# EasyEDA Pro project ProPrj_主车电路板.epro, schematic 主控板
Board Name: 主控板; Create Date: 2025-03-30; Page Name: P1; Project Name: 主车电路板; Schematic Name: 主控板; Update Date: 2025-04-03; Company: 嘉立创EDA; Drawed: 李子晞; Page Size: A4; Version: V1.0
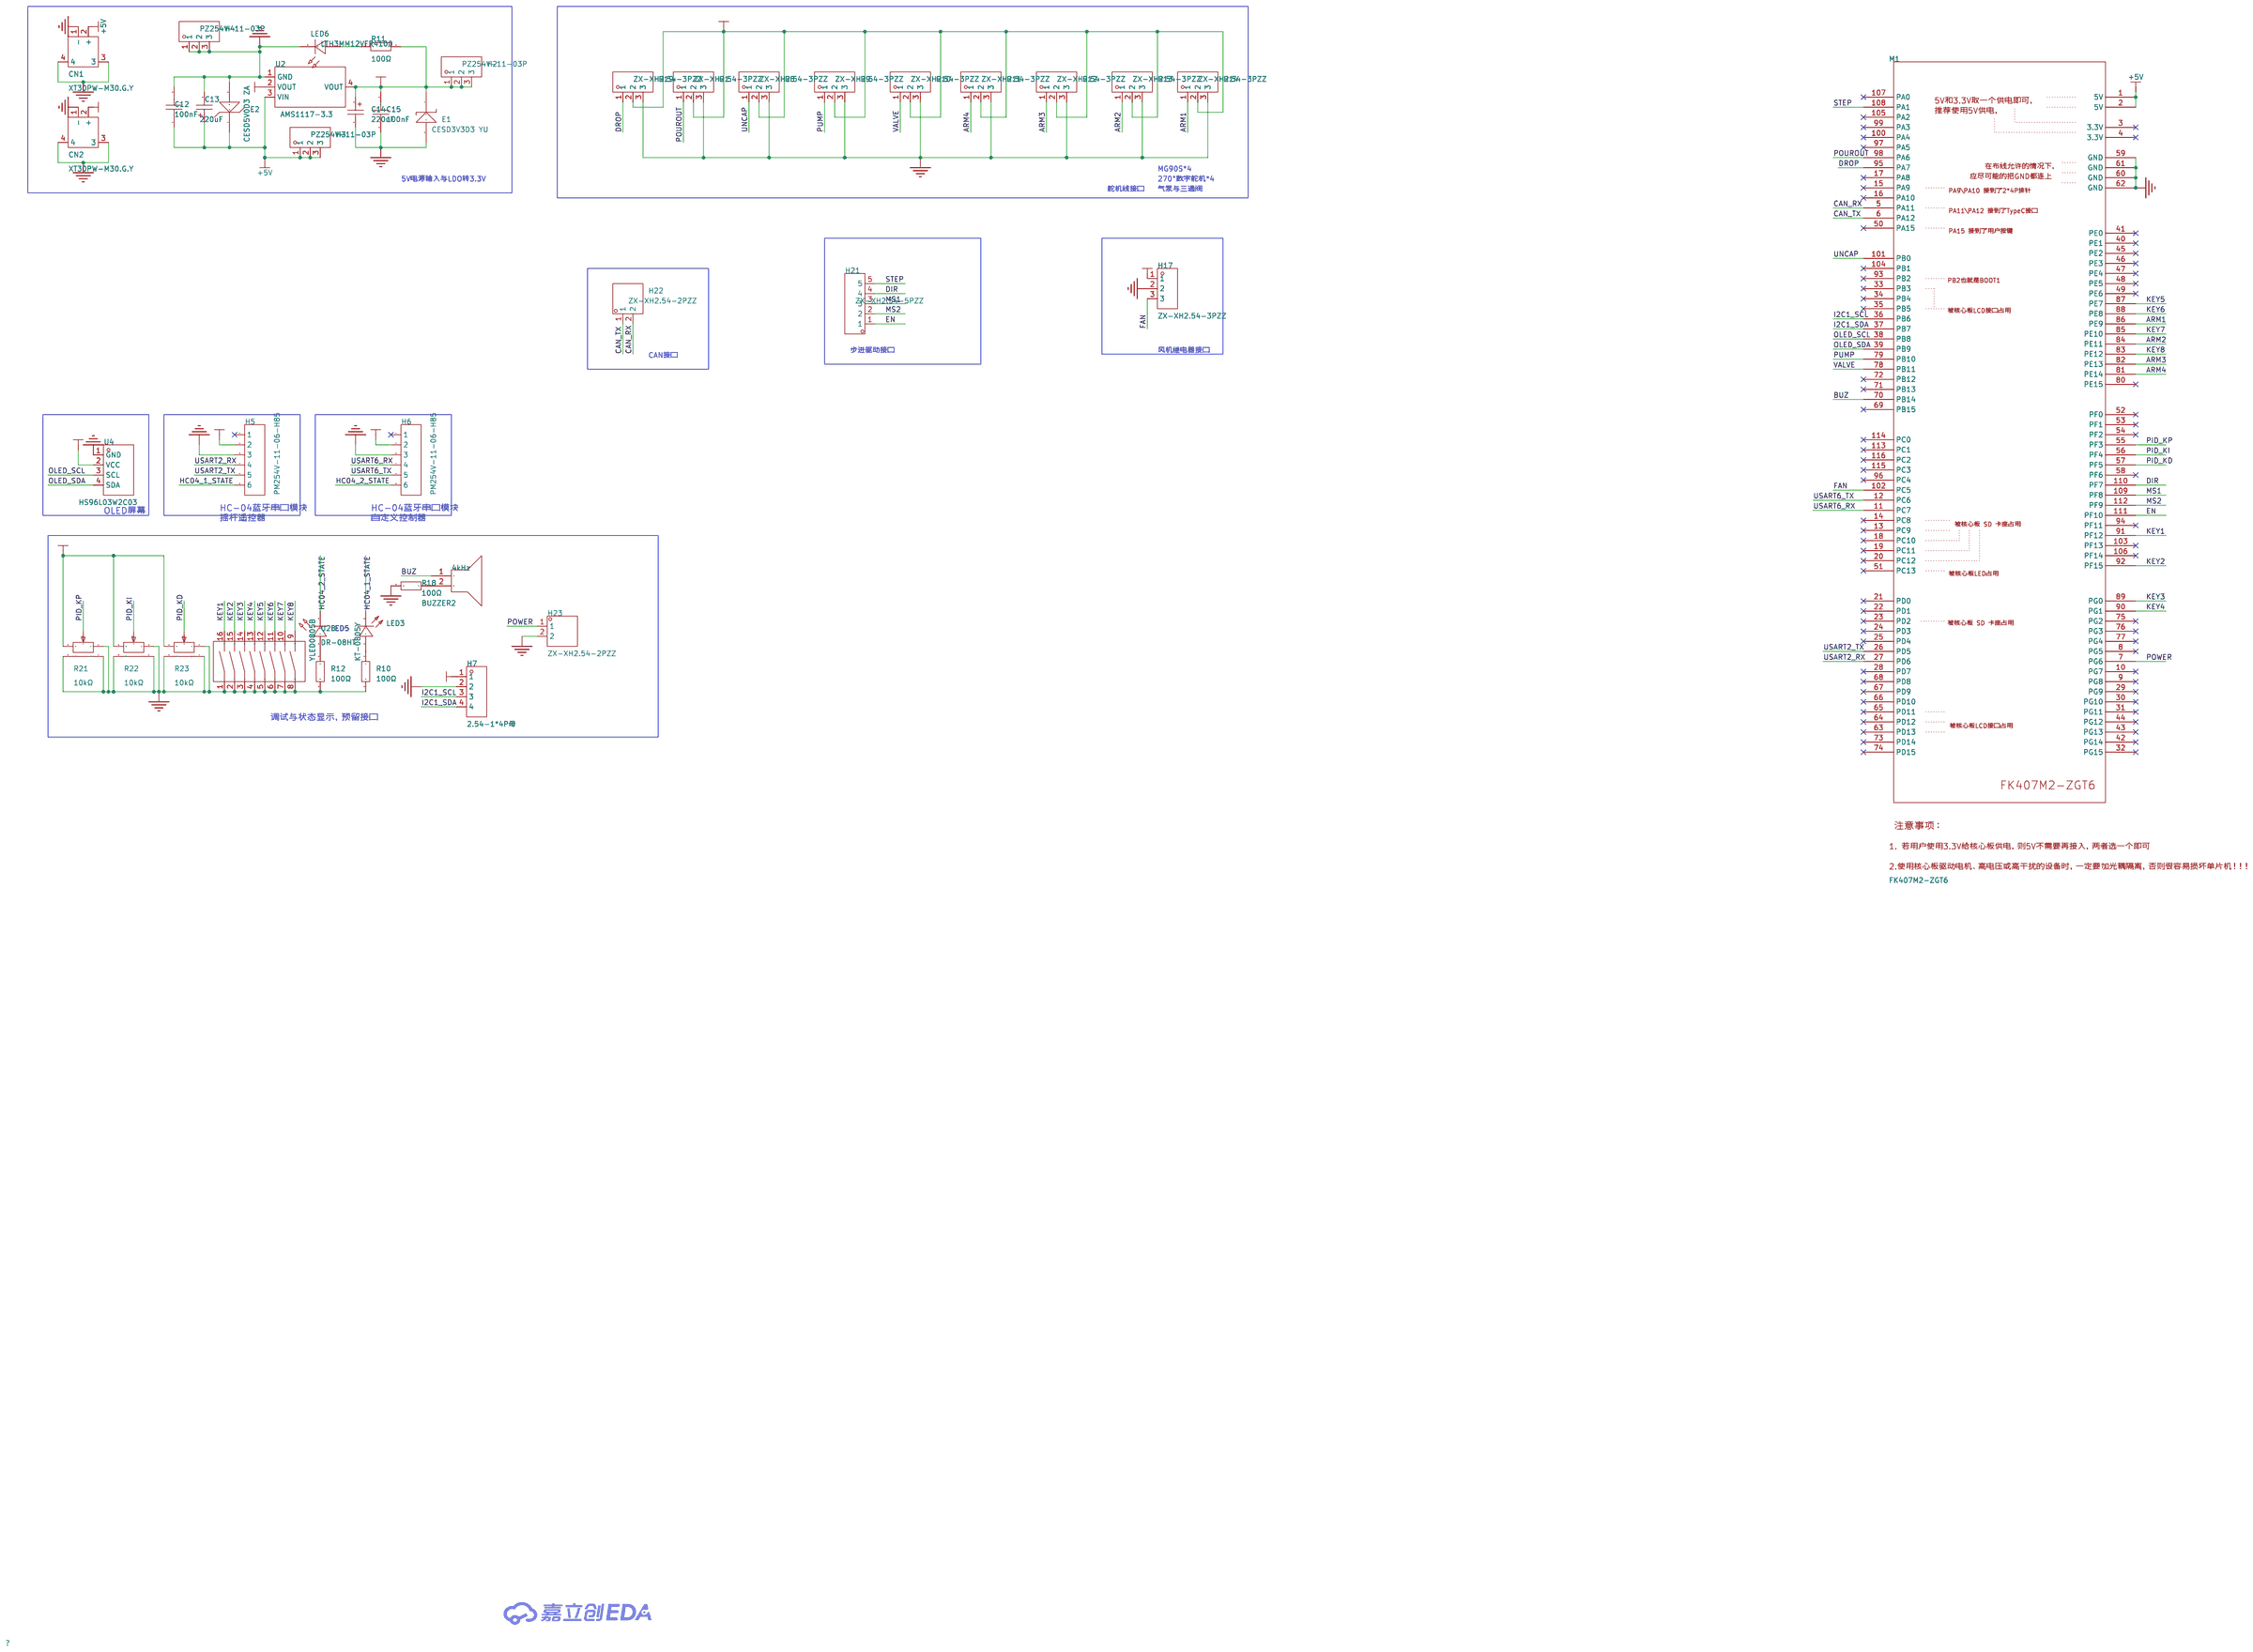
[diagram p2: schematic sheet]

## Parts
BUZZER2  4kHz  [BUZ-SMD_L12.0-W12.0-P11.6]
C12  100nF  [C0603]
C13  220uF  [CASE-B_3528]
C14  220uF  [CASE-B_3528]
C15  100nF  [C0603]
CN1  XT30PW-M30.G.Y  [CONN-TH_XT30PW-M]
CN2  XT30PW-M30.G.Y  [CONN-TH_XT30PW-M]
E1  CESD3V3D3 YU  [SOD-323_L1.8-W1.3-LS2.5-RD]
E2  CESD5V0D3 ZA  [SOD-323_L1.8-W1.3-LS2.5-RD]
H1  ZX-XH2.54-3PZZ  [CONN-TH_3P-P2.54_2501S-3P]
H2  PZ254V-11-03P  [HDR-TH_3P-P2.54-V-M]
H3  PZ254V-11-03P  [HDR-TH_3P-P2.54-V-M]
H4  PZ254V-11-03P  [HDR-TH_3P-P2.54-V-M]
H5  PM254V-11-06-H85  [HDR-TH_6P-P2.54-V-F]
H6  PM254V-11-06-H85  [HDR-TH_6P-P2.54-V-F]
H7  2.54-1*4P母  [HDR-TH_4P-P2.54-V-F]
H8  ZX-XH2.54-3PZZ  [CONN-TH_3P-P2.54_2501S-3P]
H9  ZX-XH2.54-3PZZ  [CONN-TH_3P-P2.54_2501S-3P]
H10  ZX-XH2.54-3PZZ  [CONN-TH_3P-P2.54_2501S-3P]
H11  ZX-XH2.54-3PZZ  [CONN-TH_3P-P2.54_2501S-3P]
H12  ZX-XH2.54-3PZZ  [CONN-TH_3P-P2.54_2501S-3P]
H13  ZX-XH2.54-3PZZ  [CONN-TH_3P-P2.54_2501S-3P]
H14  ZX-XH2.54-3PZZ  [CONN-TH_3P-P2.54_2501S-3P]
H17  ZX-XH2.54-3PZZ  [CONN-TH_3P-P2.54_2501S-3P]
H19  ZX-XH2.54-3PZZ  [CONN-TH_3P-P2.54_2501S-3P]
H21  ZX-XH2.54-5PZZ  [CONN-TH_5P-P2.50_ZX-XH2.54-5PZZ]
H22  ZX-XH2.54-2PZZ  [CONN-TH_2P-P2.50_HX25003-2A]
H23  ZX-XH2.54-2PZZ  [CONN-TH_2P-P2.50_HX25003-2A]
LED3  KT-0805Y  [LED0805-R-RD]
LED5  YLED0805B  [LED0805-RD]
LED6  LTH3MM12VFR4100  [LED-TH_BD3.8-P2.54-RD]
M1  FK407M2-ZGT6  [FK407M2-ZGT6]
R10  100Ω  [R0805]
R11  100Ω  [R0805]
R12  100Ω  [R0805]
R18  100Ω  [R0805]
R21  10kΩ  [RES-ADJ-TH_RK09K1130AJ3]
R22  10kΩ  [RES-ADJ-TH_RK09K1130AJ3]
R23  10kΩ  [RES-ADJ-TH_RK09K1130AJ3]
U2  AMS1117-3.3  [SOT-223-3_L6.5-W3.4-P2.30-LS7.0-BR]
U4  HS96L03W2C03  [OLED-TH_L27.8-W27.2-P2.54_C9900033791]
U28  DR-08HT  [SW-TH_16P-P2.54_SMQS-08B-TP]

## Library data of the parts
BUZZER2 = YS-SBZ1230: 驱动方式:无源(外部驱动);频率:4kHz;声压(SPL):80dB;; LCSC Part Name: 贴片无源蜂鸣器; Supplier Part: C409829; Manufacturer: Fengming(锋鸣电子); Supplier Footprint: SMD,12x12mm; JLCPCB Part Class: 扩展库; Datasheet: https://atta.szlcsc.com/upload/public/pdf/source/20191217/C409829_13DEFC1C65878FEE1B941728A336D6D3.pdf; Supplier: LCSC; Driver Circuitry: 无源(外部驱动); Sound Pressure Level(SPL): 80dB; Length: 12mm; Width: 12mm; Height: 3.3mm
C12 C15 = CGA0603X7R104K500JT: 容值:100nF;精度:±10%;额定电压:50V;材质(温度系数):X7R;; LCSC Part Name: 100nF ±10% 50V; Supplier Part: C6119867; Manufacturer: HRE(芯声); Supplier Footprint: 0603; JLCPCB Part Class: Extended Part; Supplier: LCSC; Tolerance: ±10%; Voltage Rated: 50V; Temperature Coefficient: X7R
C13 C14 = TLJB227M006R0500: 容值:220uF;精度:±20%;额定电压:6.3V;等效串联电阻:500mΩ@100kHz;; LCSC Part Name: 220uF ±20% 6.3V; Supplier Part: C30242; Manufacturer: Kyocera AVX; Supplier Footprint: CASE-B-3528-21(mm); JLCPCB Part Class: 扩展库; Datasheet: https://atta.szlcsc.com/upload/public/pdf/source/20181016/C313517_95E099C94D57B8A6005DAF15C3058A23.pdf; Supplier: LCSC; Tolerance: ±20%; Rated Voltage: 6.3V; Equivalent Series Resistance(ESR): 500mΩ@100kHz; Operating Temperature: -55℃~+125℃
CN1 CN2 = XT30PW-M30.G.Y: 类别:-;类型1:-;; LCSC Part Name: AMASS(艾迈斯)航模插头 卧式弯脚 XT30PW-M公头; Supplier Part: C431092; Manufacturer: AMASS(艾迈斯); JLCPCB Part Class: 扩展库; Datasheet: https://atta.szlcsc.com/upload/public/pdf/source/20220222/6A9F22F7850E25B33E1BE430ADF8560B.pdf; Supplier: LCSC; Type: 航模插头; RatedVoltage: DC 500V; InterfaceType: 公头; RatedCurrent: 15A; RecommendedWireGauge: 16/18/20AWG; contact resistance: 1.2mΩ; specifications: 2pin
E1 = CESD3V3D3 YU: 极性:单向;反向截止电压(Vrwm):3.3V;最大钳位电压:13V;峰值脉冲电流(Ipp):16A;击穿电压:5V;; LCSC Part Name: 单向ESD; Supplier Part: C38388; Manufacturer: CJ(江苏长电/长晶); Supplier Footprint: SOD-323; JLCPCB Part Class: 扩展库; Datasheet: https://atta.szlcsc.com/upload/public/pdf/source/20150915/1457707371129.pdf; Supplier: LCSC; polarity: 单向; Reverse Stand-Off Voltage (Vrwm): 3.3V; Maximum Clamping Voltage: 13V; Peak Pulse Current (Ipp): 16A; Breakdown Voltage: 5V; Type: ESD
E2 = CESD5V0D3 ZA: 极性:单向;反向截止电压(Vrwm):5V;最大钳位电压:15.5V;峰值脉冲电流(Ipp):15A;击穿电压:6.2V;; LCSC Part Name: 单向ESD; Supplier Part: C22643; Manufacturer: CJ(江苏长电/长晶); Supplier Footprint: SOD-323; JLCPCB Part Class: 扩展库; Datasheet: https://atta.szlcsc.com/upload/public/pdf/source/20140301/1457707004115.pdf; Supplier: LCSC; polarity: 单向; Reverse Stand-Off Voltage (Vrwm): 5V; Maximum Clamping Voltage: 15.5V; Peak Pulse Current (Ipp): 15A; Breakdown Voltage: 6.2V; Type: ESD
H1 H8-H14 H17 H19 = ZX-XH2.54-3PZZ: 插针结构:1x3P;间距:2.5mm;安装方式:直插;参考系列:XH;总PIN数:3P;排数:1;每排PIN数:3;行距:-;额定电流:3A;触头材质:黄铜;触头镀层:锡;工作温度范围:-25℃~+85℃;; LCSC Part Name: 1x3P 间距:2.5mm 直插 系列:XH; Supplier Part: C7429633; Manufacturer: Megastar(兆星); Supplier Footprint: 插件,P=2.5mm; JLCPCB Part Class: Extended Part; Datasheet: https://atta.szlcsc.com/upload/public/pdf/source/20230619/AE17037A2CFDBE8D9CBA775D61AD0A84.pdf; Supplier: LCSC; Pins Structure: 1x3P; Pitch: 2.5mm; Mounting Type: 直插; Reference Series: XH; Number of Pins: 3P; Number of Rows: 1; Number of PINs Per Row: 3; Rated Current: 3A; Contact Material: 黄铜; Contact Plating: 锡; Operating Temperature: -25℃~+85℃; Rated Voltage (Max): 250V; Plastic Material: PA66; Flame Retardant Rating: UL94V-0; Color: 白色; Z-Height of the Board: 7mm; X-Length of Bottom Edge on Board (Spacing Line): 10mm; Y-Width of Bottom Edge on Board: 5.9mm
H2-H4 = PZ254V-11-03P: 插针结构:1x3P;间距:2.54mm;行距:-;圆针/方针:方针;安装方式:直插;排数:单排;总PIN位数:3P;额定电流:3A;额定电压:250V;配合针长度:6mm;塑高:2.5mm;端接针长度:3mm;工作温度:-40℃~+105℃;颜色:黑色;; LCSC Part Name: 1x3P 间距:2.54mm 方针 直插; Supplier Part: C2937625; Manufacturer: XFCN(兴飞); Supplier Footprint: 插件,P=2.54mm; JLCPCB Part Class: Extended Part; Datasheet: https://atta.szlcsc.com/upload/public/pdf/source/20200309/C492402_8335C3D49C4E4C618838D59BB1D024C1.pdf; Supplier: LCSC; Pin Structure: 1x3P; Pitch: 2.54mm; Circluar Pins/Square Pins: 方针; Mounting Type: 直插; Number of Rows: 单排; Number of Pins: 3P; Current Rating: 3A; Voltage Rating (Max): 250V; Length of Mating Pin: 6mm; Insulation Height: 2.5mm; Length of End Connection Pin: 3mm; Operating Temperature: -40℃~+105℃; Color: 黑色
H5 H6 = PM254V-11-06-H85: 插孔结构:1x6P;间距:2.54mm;行距:-;圆孔/方孔:方孔;安装类型:直插;排数:单排;总孔位数:6P;额定电流:3A;额定电压:250V;插孔方向:顶部;塑高:-;工作温度范围:-40℃~+105℃;; LCSC Part Name: 间距:2.54mm 1x6P 直插; Supplier Part: C2832269; Manufacturer: XFCN(兴飞); Supplier Footprint: 插件,P=2.54mm; JLCPCB Part Class: Extended Part; Datasheet: https://atta.szlcsc.com/upload/public/pdf/source/20210514/C2832269_B3EC97736B37C2783BDCE3050AA57447.pdf; Supplier: LCSC; Holes Structure: 1x6P; Pitch: 2.54mm; Circular Hole / Square Hole: 方孔; Mounting Type: 直插; Number of Rows: 单排; Number of Holes: 6P; Current Rating (Max): 3A; Voltage Rating (Max): 250V; Holes Direction: 顶部; Operating Temperature Range: -40℃~+105℃
H7 = 2.54-1*4P母: 插孔结构:1x4P;间距:2.54mm;行距:-;圆孔/方孔:方孔;安装类型:直插;排数:单排;总孔位数:4P;额定电流:3A;额定电压:-;插孔方向:顶部;塑高:-;触头材质:青铜;触头镀层:-;工作温度范围:-40℃~+105℃;焊接温度(最大值):-;; LCSC Part Name: 间距:2.54mm 1x4P 直插; Supplier Part: C2718488; Manufacturer: BOOMELE(博穆精密); Supplier Footprint: 插件,P=2.54mm; JLCPCB Part Class: Extended Part; Datasheet: https://atta.szlcsc.com/upload/public/pdf/source/20210301/C2718488_F4427B881E42CAA8DDB0B1C12B3A522C.pdf; Supplier: LCSC; Holes Structure: 1x4P; Pitch: 2.54mm; Circular Hole / Square Hole: 方孔; Mounting Type: 直插; Number of Rows: 单排; Number of Holes: 4P; Current Rating (Max): 3A; Holes Direction: 顶部; Contact Material: 青铜; Operating Temperature Range: -40℃~+105℃
H21 = ZX-XH2.54-5PZZ: 插针结构:1x5P;间距:2.5mm;安装方式:直插;参考系列:XH;总PIN数:5P;排数:1;每排PIN数:5;行距:-;额定电流:3A;触头材质:黄铜;触头镀层:锡;工作温度范围:-25℃~+85℃;; LCSC Part Name: 1x5P 间距:2.5mm 直插 系列:XH; Supplier Part: C7429635; Manufacturer: Megastar(兆星); Supplier Footprint: 插件,P=2.5mm; JLCPCB Part Class: Extended Part; Datasheet: https://atta.szlcsc.com/upload/public/pdf/source/20230619/60EEF4ADD558E90BFFACF5D939816781.pdf; Supplier: LCSC; Pins Structure: 1x5P; Pitch: 2.5mm; Mounting Type: 直插; Reference Series: XH; Number of Pins: 5P; Number of Rows: 1; Number of PINs Per Row: 5; Rated Current: 3A; Contact Material: 黄铜; Contact Plating: 锡; Operating Temperature: -25℃~+85℃; Rated Voltage (Max): 250V; Plastic Material: PA66; Flame Retardant Rating: UL94V-0; Color: 白色; Z-Height of the Board: 7mm; X-Length of Bottom Edge on Board (Spacing Line): 15mm; Y-Width of Bottom Edge on Board: 5.9mm
H22 H23 = ZX-XH2.54-2PZZ: 插针结构:1x2P;间距:2.5mm;安装方式:直插;参考系列:XH;总PIN数:2P;排数:1;每排PIN数:2;行距:-;额定电流:3A;触头材质:黄铜;触头镀层:锡;工作温度范围:-25℃~+85℃;; LCSC Part Name: 1x2P 间距:2.5mm 直插 系列:XH; Supplier Part: C7429632; Manufacturer: Megastar(兆星); Supplier Footprint: 插件,P=2.5mm; JLCPCB Part Class: Extended Part; Datasheet: https://atta.szlcsc.com/upload/public/pdf/source/20230619/19BA6947230AA44A04D3EDD65E618FD0.pdf; Supplier: LCSC; Pins Structure: 1x2P; Pitch: 2.5mm; Mounting Type: 直插; Reference Series: XH; Number of Pins: 2P; Number of Rows: 1; Number of PINs Per Row: 2; Rated Current: 3A; Contact Material: 黄铜; Contact Plating: 锡; Operating Temperature: -25℃~+85℃; Rated Voltage (Max): 250V; Plastic Material: PA66; Flame Retardant Rating: UL94V-0; Color: 白色; Z-Height of the Board: 7mm; X-Length of Bottom Edge on Board (Spacing Line): 7.5mm; Y-Width of Bottom Edge on Board: 5.9mm
LED3 = KT-0805Y: 发光颜色:黄色;功率:-;正向电流:-;主波长:-;二极管配置:-;透镜颜色:-;色温:-;发光角度:-;载带方式:-;工作温度:-;; LCSC Part Name: 0805 黄灯 高亮; Supplier Part: C2296; Manufacturer: KENTO; Supplier Footprint: 0805; JLCPCB Part Class: 基础库; Datasheet: https://atta.szlcsc.com/upload/public/pdf/source/20160421/1461205044170.pdf; Supplier: LCSC; Emitted Color: 黄色
LED5 = YLED0805B: 发光颜色:蓝色;正向电压(VF):2.7V~3.1V;功率:-;正向电流:25mA;主波长:457nm~475nm;二极管配置:-;透镜颜色:-;色温:-;发光强度:-;发光角度:-;载带方式:-;工作温度:-40℃~+85℃;; Supplier Part: C19273154; Manufacturer: YONGYUTAI(永裕泰); Supplier Footprint: 0805; JLCPCB Part Class: Extended Part; Datasheet: https://atta.szlcsc.com/upload/public/pdf/source/20231201/B2AAF083C5ADCCF8D5D977CB2CCF42BA.pdf; Supplier: LCSC; Emitted Color: 蓝色; Forward Voltage (VF): 2.7V~3.1V; Forward Current: 25mA; Dominant Wavelength: 457nm~475nm; Operating Temperature: -40℃~+85℃
LED6 = LTH3MM12VFR4100: 发光颜色:红色;正向电压(VF):12V;正向电流:12mA;主波长:625nm;透镜颜色:无色透明透镜;发光强度:2500mcd;发光角度:30°;; Supplier Part: C6657473; Manufacturer: VISHAY(威世); JLCPCB Part Class: Extended Part; Datasheet: https://atta.szlcsc.com/upload/public/pdf/source/231023/C17515122-a1ebf7c5ca7572d9d5e7a9fd39fbc982.pdf; Supplier: LCSC; Emitted Color: 红色; Forward Voltage (VF): 12V; Forward Current: 12mA; Dominant Wavelength: 625nm; Peak Wavelength: 635nm; Lens Color: 无色透明透镜; Luminous Intensity: 2500mcd; Viewing Angle: 30°
M1 = FK407M2-ZGT6: STM32F407ZGT6开发板，通用于优信和鹿小班
R10-R12 R18 = RC0805FR-07100RL: 电阻类型:厚膜电阻;阻值:100Ω;精度:±1%;功率:125mW;最大工作电压:150V;温度系数:±100ppm/℃;; LCSC Part Name: 厚膜电阻 100Ω ±1% 125mW; Supplier Part: C105577; Manufacturer: YAGEO(国巨); Supplier Footprint: 0805; JLCPCB Part Class: Extended Part; Datasheet: https://atta.szlcsc.com/upload/public/pdf/source/20180904/C276339_014E484F1DBA106FB92D45EABD5A1AC1.pdf; Supplier: LCSC; Type: 厚膜电阻; Tolerance: ±1%; Power(Watts): 125mW; Overload Voltage (Max): 150V; Temperature Coefficient: ±100ppm/℃; Operating Temperature Range: -55℃~+155℃
R21-R23 = RK09K1130AP5: 阻值:10kΩ;精度:±20%;功率:50mW;; LCSC Part Name: 10kΩ ±20%; Supplier Part: C470295; Manufacturer: ALPSALPINE(阿尔卑斯阿尔派); Supplier Footprint: 插件; JLCPCB Part Class: 扩展库; Datasheet: https://atta.szlcsc.com/upload/public/pdf/source/20191216/C470452_A95F493F84F2A4E5D2456A617FF6269D.pdf; Supplier: LCSC; Tolerance: ±20%; Rated Voltage: 20V; Power(Watts): 50mW
U2 = AMS1117-3.3_C6186: 输出类型:固定;工作电压:-;输出电压:3.3V;输出电流:1A;电源纹波抑制比(PSRR):72dB@(120Hz);输出极性:正极;; LCSC Part Name: 输出3.3V 1A; Supplier Part: C6186; Manufacturer: AMS; Supplier Footprint: SOT-223; JLCPCB Part Class: 基础库; Datasheet: https://atta.szlcsc.com/upload/public/pdf/source/20180727/C6186_7A095716F0823C02F1997A905E26C086.pdf; Supplier: LCSC; Output Type: 固定; Output Voltage: 3.3V; Output Current: 1A; Power Supply Rejection Ratio (PSRR): 72dB@(120Hz); Voltage Dropout: 1.3V@(800mA); Features: 过流保护(OCP)；热保护(TSD); Output Configuration: 正极; Number of Outputs: 1
U4 = HS96L03W2C03: 主控芯片:SSD1315;接口类型:I2C;尺寸(inch):0.96;像素分辨率:128x64;; LCSC Part Name: 0.96寸OLED显示屏窄白光IIC; Supplier Part: C5248080; Manufacturer: HS(汉昇); JLCPCB Part Class: 扩展库; Datasheet: https://atta.szlcsc.com/upload/public/pdf/source/20230627/763D01F79A90007632F098068C7C8AD9.pdf; Supplier: LCSC; Main Control Chip: SSD1315; Interface Type: I2C; Size: 0.96; Pixel Resolution: 128x64; Operating Temperature: -40℃~+70℃
U28 = DR-08HT: 类型:平拨,凸起式;电路结构:单刀单掷;开关位数:8位;额定电流:25mA;额定电压:24V;工作寿命:3千次;颜色:红色;; LCSC Part Name: 2.54mm间距 8位 琴键式 直插平拨凸柄 红色 拨码开关; Supplier Part: C18198199; Manufacturer: HANBO(汉博); Supplier Footprint: 插件,P=2.54mm; JLCPCB Part Class: 扩展库; Datasheet: https://atta.szlcsc.com/upload/public/pdf/source/20230921/1B22663749515D82B4C7D499D4F055EF.pdf; Supplier: LCSC; Type: 平拨,凸起式; Circuit: 单刀单掷; Number of Positions: 8位; Lead Pitch: 2.54mm; Current Rating: 25mA; Voltage Rating: 24V; Operating Temperature: -40℃~+85℃; Operating Life: 3千次; Color: 红色

## Nets
3V3: C14.1 C15.2 E1.1 H2.1 H2.2 H2.3 H5.2 H6.2 H7.1 R11.2 R21.3 R22.3 R23.3 U2.2(VOUT) U2.4(VOUT) U4.2(VCC)
+5V: C12.1 C13.1 CN1.2(+) E2.1 H3.1 H3.2 H3.3 M1.1(5V) M1.2(5V) U2.3(VIN)
GND: C12.2 C13.2 C14.2 C15.1 CN1.1(-) CN1.3 CN1.4 CN2.1(-) CN2.3 CN2.4 E1.2 E2.2 H1.3 H4.1 H4.2 H4.3 H5.3 H6.3 H7.2 H8.3 H9.3 H10.3 H11.3 H12.3 H13.3 H14.3 H17.2 H19.3 H23.2 LED6.2(A) M1.59(GND) M1.60(GND) M1.61(GND) M1.62(GND) R10.2 R12.2 R18.2 R21.1 R21.4 R21.5 R22.1 R22.4 R22.5 R23.1 R23.4 R23.5 U2.1(GND) U4.1(GND) U28.1 U28.2 U28.3 U28.4 U28.5 U28.6 U28.7 U28.8
ARM1: H14.1 M1.86(PE9)
ARM2: H13.1 M1.84(PE11)
ARM3: H12.1 M1.82(PE13)
ARM4: H11.1 M1.81(PE14)
BUZ: BUZZER2.1 M1.70(PB14)
CAN_RX: H22.2 M1.5(PA11)
CAN_TX: H22.1 M1.6(PA12)
DIR: H21.4 M1.110(PF7)
DROP: H19.1 M1.95(PA7)
EN: H21.1 M1.111(PF10)
FAN: H17.3 M1.102(PC5)
HC04_1_STATE: H5.6 LED3.2(-)
HC04_2_STATE: H6.6 LED5.1(C)
I2C1_SCL: H7.3 M1.36(PB6)
I2C1_SDA: H7.4 M1.37(PB7)
KEY1: M1.91(PF12) U28.16
KEY2: M1.92(PF15) U28.15
KEY3: M1.89(PG0) U28.14
KEY4: M1.90(PG1) U28.13
KEY5: M1.87(PE7) U28.12
KEY6: M1.88(PE8) U28.11
KEY7: M1.85(PE10) U28.10
KEY8: M1.83(PE12) U28.9
MS1: H21.3 M1.109(PF8)
MS2: H21.2 M1.112(PF9)
OLED_SCL: M1.38(PB8) U4.3(SCL)
OLED_SDA: M1.39(PB9) U4.4(SDA)
PID_KD: M1.57(PF5) R23.2
PID_KI: M1.56(PF4) R22.2
PID_KP: M1.55(PF3) R21.2
POUROUT: H1.1 M1.98(PA6)
POWER: H23.1 M1.7(PG6)
PUMP: H9.1 M1.79(PB10)
STEP: H21.5 M1.108(PA1)
UNCAP: H8.1 M1.101(PB0)
USART2_RX: H5.4 M1.27(PD6)
USART2_TX: H5.5 M1.26(PD5)
USART6_RX: H6.4 M1.11(PC7)
USART6_TX: H6.5 M1.12(PC6)
VALVE: H10.1 M1.78(PB11)
VS: CN2.2(+) H1.2 H8.2 H9.2 H10.2 H11.2 H12.2 H13.2 H14.2 H17.1 H19.2
$1N1967: LED6.1(C) R11.1
$1N3310: BUZZER2.2 R18.1
$1N3328: LED3.1(+) R10.1
$1N3330: LED5.2(A) R12.1

Not connected (* = marked no-connect by the designer): H5 1*; H6 1*; M1 3(3.3V)* 4(3.3V)* 8(PG5)* 9(PG8)* 10(PG7)* 13(PC9)* 14(PC8)* 15(PA9)* 16(PA10)* 17(PA8)* 18(PC10)* 19(PC11)* 20(PC12)* 21(PD0)* 22(PD1)* 23(PD2)* 24(PD3)* 25(PD4)* 28(PD7)* 29(PG9)* 30(PG10)* 31(PG11)* 32(PG15)* 33(PB3)* 34(PB4)* 35(PB5)* 40(PE1)* 41(PE0)* 42(PG14)* 43(PG13)* 44(PG12)* 45(PE2)* 46(PE3)* 47(PE4)* 48(PE5)* 49(PE6)* 50(PA15)* 51(PC13)* 52(PF0)* 53(PF1)* 54(PF2)* 58(PF6)* 63(PD13)* 64(PD12)* 65(PD11)* 66(PD10)* 67(PD9)* 68(PD8)* 69(PB15)* 71(PB13)* 72(PB12)* 73(PD14)* 74(PD15)* 75(PG2)* 76(PG3)* 77(PG4)* 80(PE15)* 93(PB2)* 94(PF11)* 96(PC4)* 97(PA5)* 99(PA3)* 100(PA4)* 103(PF13)* 104(PB1)* 105(PA2)* 106(PF14)* 107(PA0)* 113(PC1)* 114(PC0)* 115(PC3)* 116(PC2)*

## Notes on the sheet
- MG90S*4
- 5V电源输入与LDO转3.3V
- 270°数字舵机*4
- 舵机线接口
- 气泵与三通阀
- 步进驱动接口
- 风机继电器接口
- CAN接口
- HC-04蓝牙串口模块
  摇杆遥控器
- HC-04蓝牙串口模块
  自定义控制器
- OLED屏幕
- 调试与状态显示，预留接口
